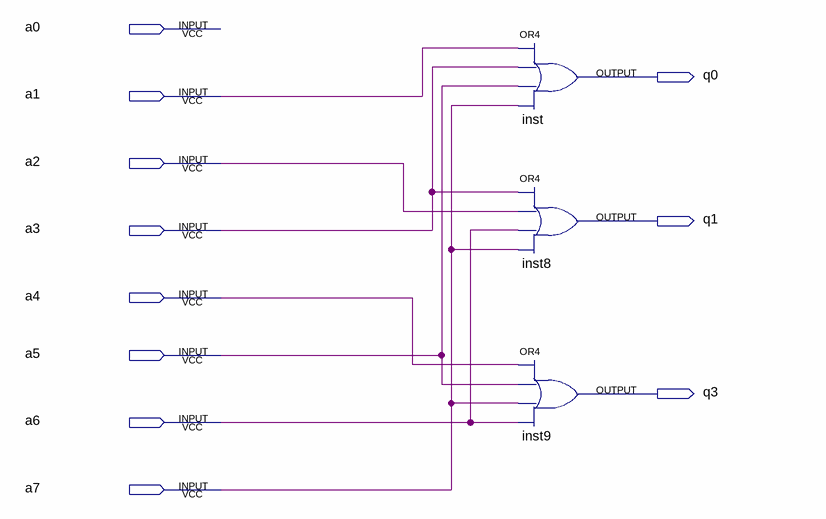
[diagram p0: schematic sheet]
// Quartus schematic lab02_2.bdf as structural Verilog: 3 symbols, 11 pins
module lab02_2 (
  input  a0,
  input  a1,
  input  a2,
  input  a3,
  input  a4,
  input  a5,
  input  a6,
  input  a7,
  output q0,
  output q1,
  output q3
);

  or inst (q0, a1, a3, a5, a7);
  or inst8 (q1, a3, a2, a6, a7);
  or inst9 (q3, a4, a5, a7, a6);
endmodule
